# Altium schematic sheet [01] - COVER PAGE.SchDoc
size A3; DocumentNumber: 1; SheetNumber: 1; SheetTotal: 6
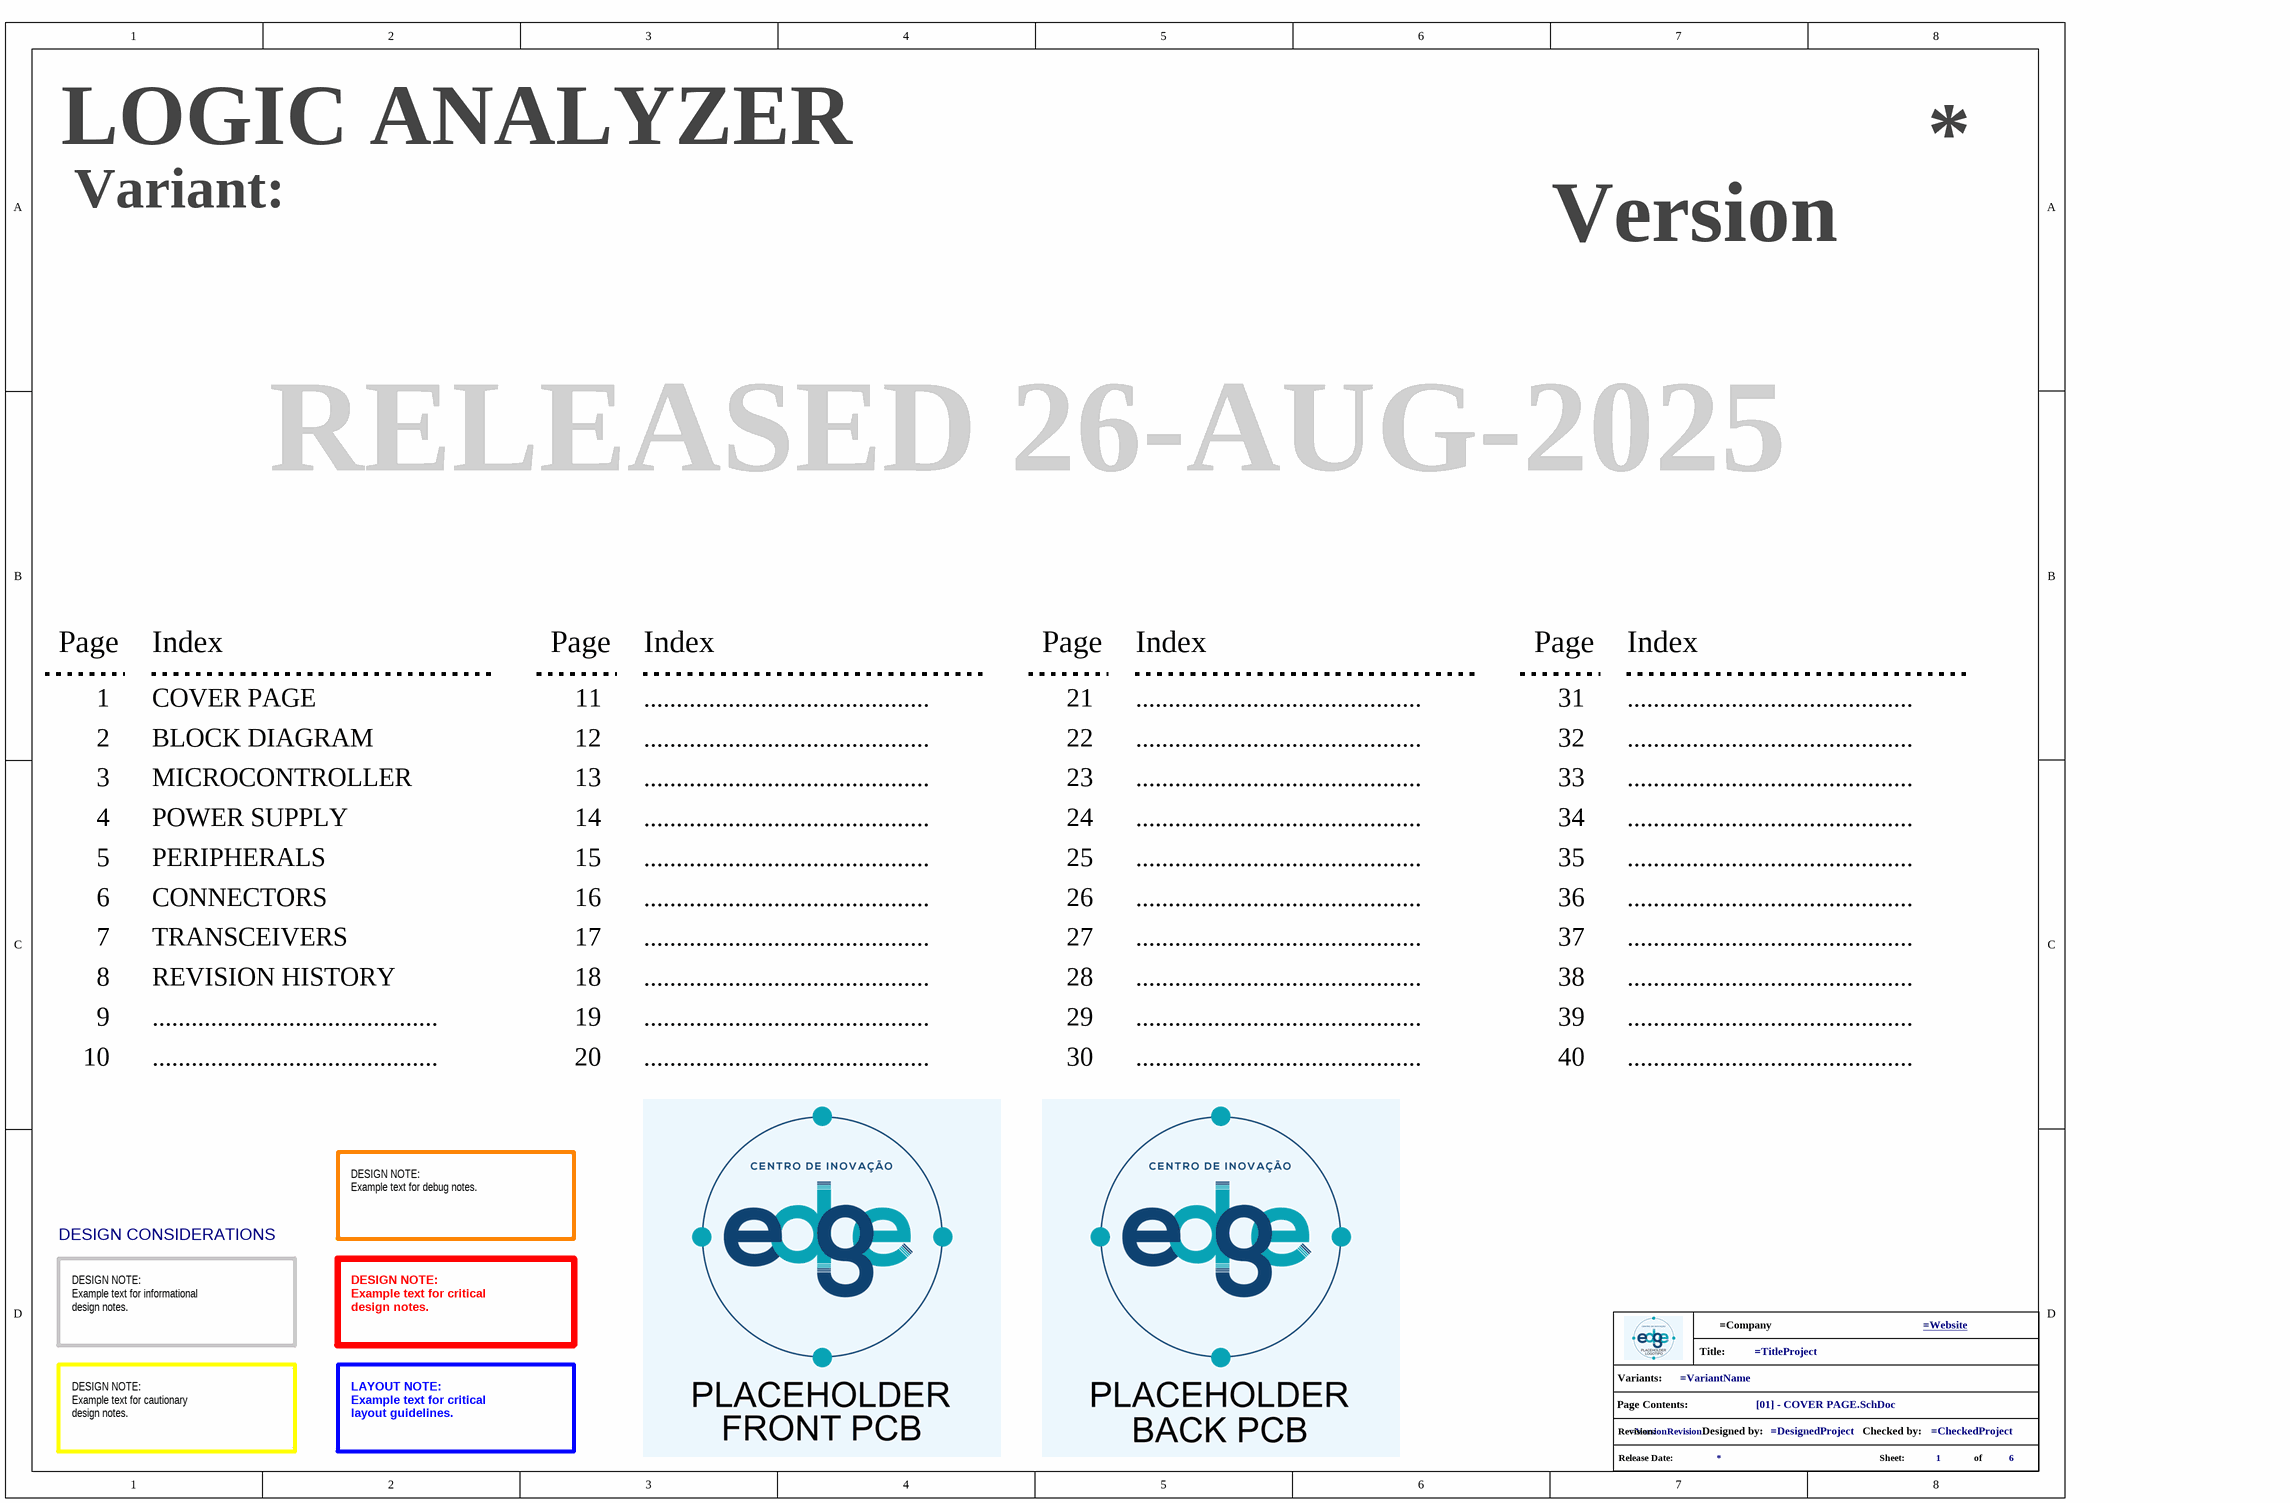
[diagram p0: [01] - COVER PAGE.SchDoc]

## Parts
*?  info_project  (value not drawn)  (graphical)

## Notes on the sheet
- LOGIC ANALYZER
- Variant:
- Version
- RELEASED 26-AUG-2025
- Page
- Index
- 1
- COVER PAGE
- 11
- ............................................
- 21
- 31
- 2
- 3
- BLOCK DIAGRAM
- MICROCONTROLLER
- 12
- 13
- 22
- 23
- 32
- 33
- 4
- POWER SUPPLY
- 14
- 24
- 34
- 5
- 6
- PERIPHERALS
- CONNECTORS
- 15
- 16
- 25
- 26
- 35
- 36
- 7
- 8
- TRANSCEIVERS
- REVISION HISTORY
- 17
- 18
- 27
- 28
- 37
- 38
- 9
- 19
- 29
- 39
- 10
- 20
- 30
- 40
- DESIGN CONSIDERATIONS
- DESIGN NOTE:
  Example text for debug notes.
- DESIGN NOTE:
  Example text for informational
  design notes.
- DESIGN NOTE:
  Example text for critical
  design notes.
- DESIGN NOTE:
  Example text for cautionary
  design notes.
- LAYOUT NOTE:
  Example text for critical
  layout guidelines.
- (in symbol info_project) Title:; Variants:; Page Contents:; Revision:; Designed by:; Checked by:; Release Date:; Sheet:; of